# Altium schematic sheet StepperDriver.SchDoc
size A
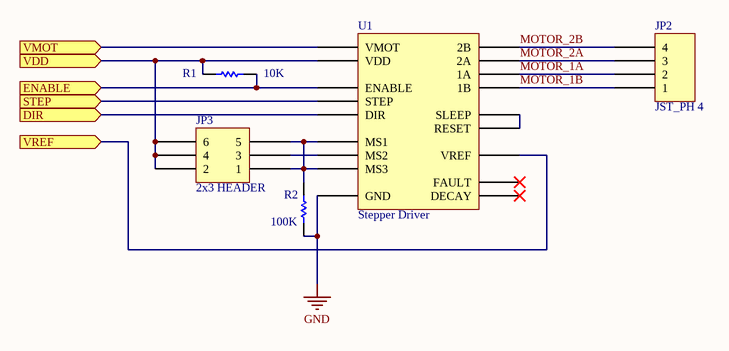
[diagram p0: StepperDriver.SchDoc]

## Parts
JP2  JST_PH 4  [JST_PH 4]
JP3  2x3 HEADER  [2x3 HEADER]
R1  10K  [RESC0603(1608)_N]
R2  100K  [RESC0603(1608)_N]
U1  Stepper Driver  [SureStepr]

## Ports
DIR (in), ENABLE (in), STEP (in), VDD (in), VMOT (in), VREF (in)

## Nets
GND: R2.1 U1.GND
DIR: U1.DIR ; port DIR
ENABLE: R1.1 U1.ENABLE ; port ENABLE
MOTOR_1A: JP2.2 U1.1A
MOTOR_1B: JP2.1 U1.1B
MOTOR_2A: JP2.3 U1.2A
MOTOR_2B: JP2.4 U1.2B
STEP: U1.STEP ; port STEP
VDD: JP3.2 JP3.4 JP3.6 R1.2 U1.VDD ; port VDD
VMOT: U1.VMOT ; port VMOT
VREF: U1.VREF ; port VREF
NetJP3_1: JP3.1 JP3.5 R2.2 U1.MS1 U1.MS3
NetJP3_3: JP3.3 U1.MS2
NetU1_RESET: U1.RESET U1.SLEEP

Not connected (* = marked no-connect by the designer): U1 DECAY* FAULT*

## Library data of the parts
R1 = CMP-1012-00098-1: 10K 0.1W 5% 0603 (1608 Metric)  SMD; Case-EIA: 0603; Value: 10000.00 Ohm; Case-Metric: 1608; Technology: SMT; Tolerance: 5 %; Power: 0.1 W
R2 = CMP-1012-00122-1: 100K 0.1W 5% 0603 (1608 Metric)  SMD; Case-EIA: 0603; Value: 100000.00 Ohm; Case-Metric: 1608; Tolerance: 5 %; Power: 0.1 W; Technology: SMT